# EasyEDA Pro project HV55708转接板.eprj

# Schematic Schematic1
Board Name: Board1
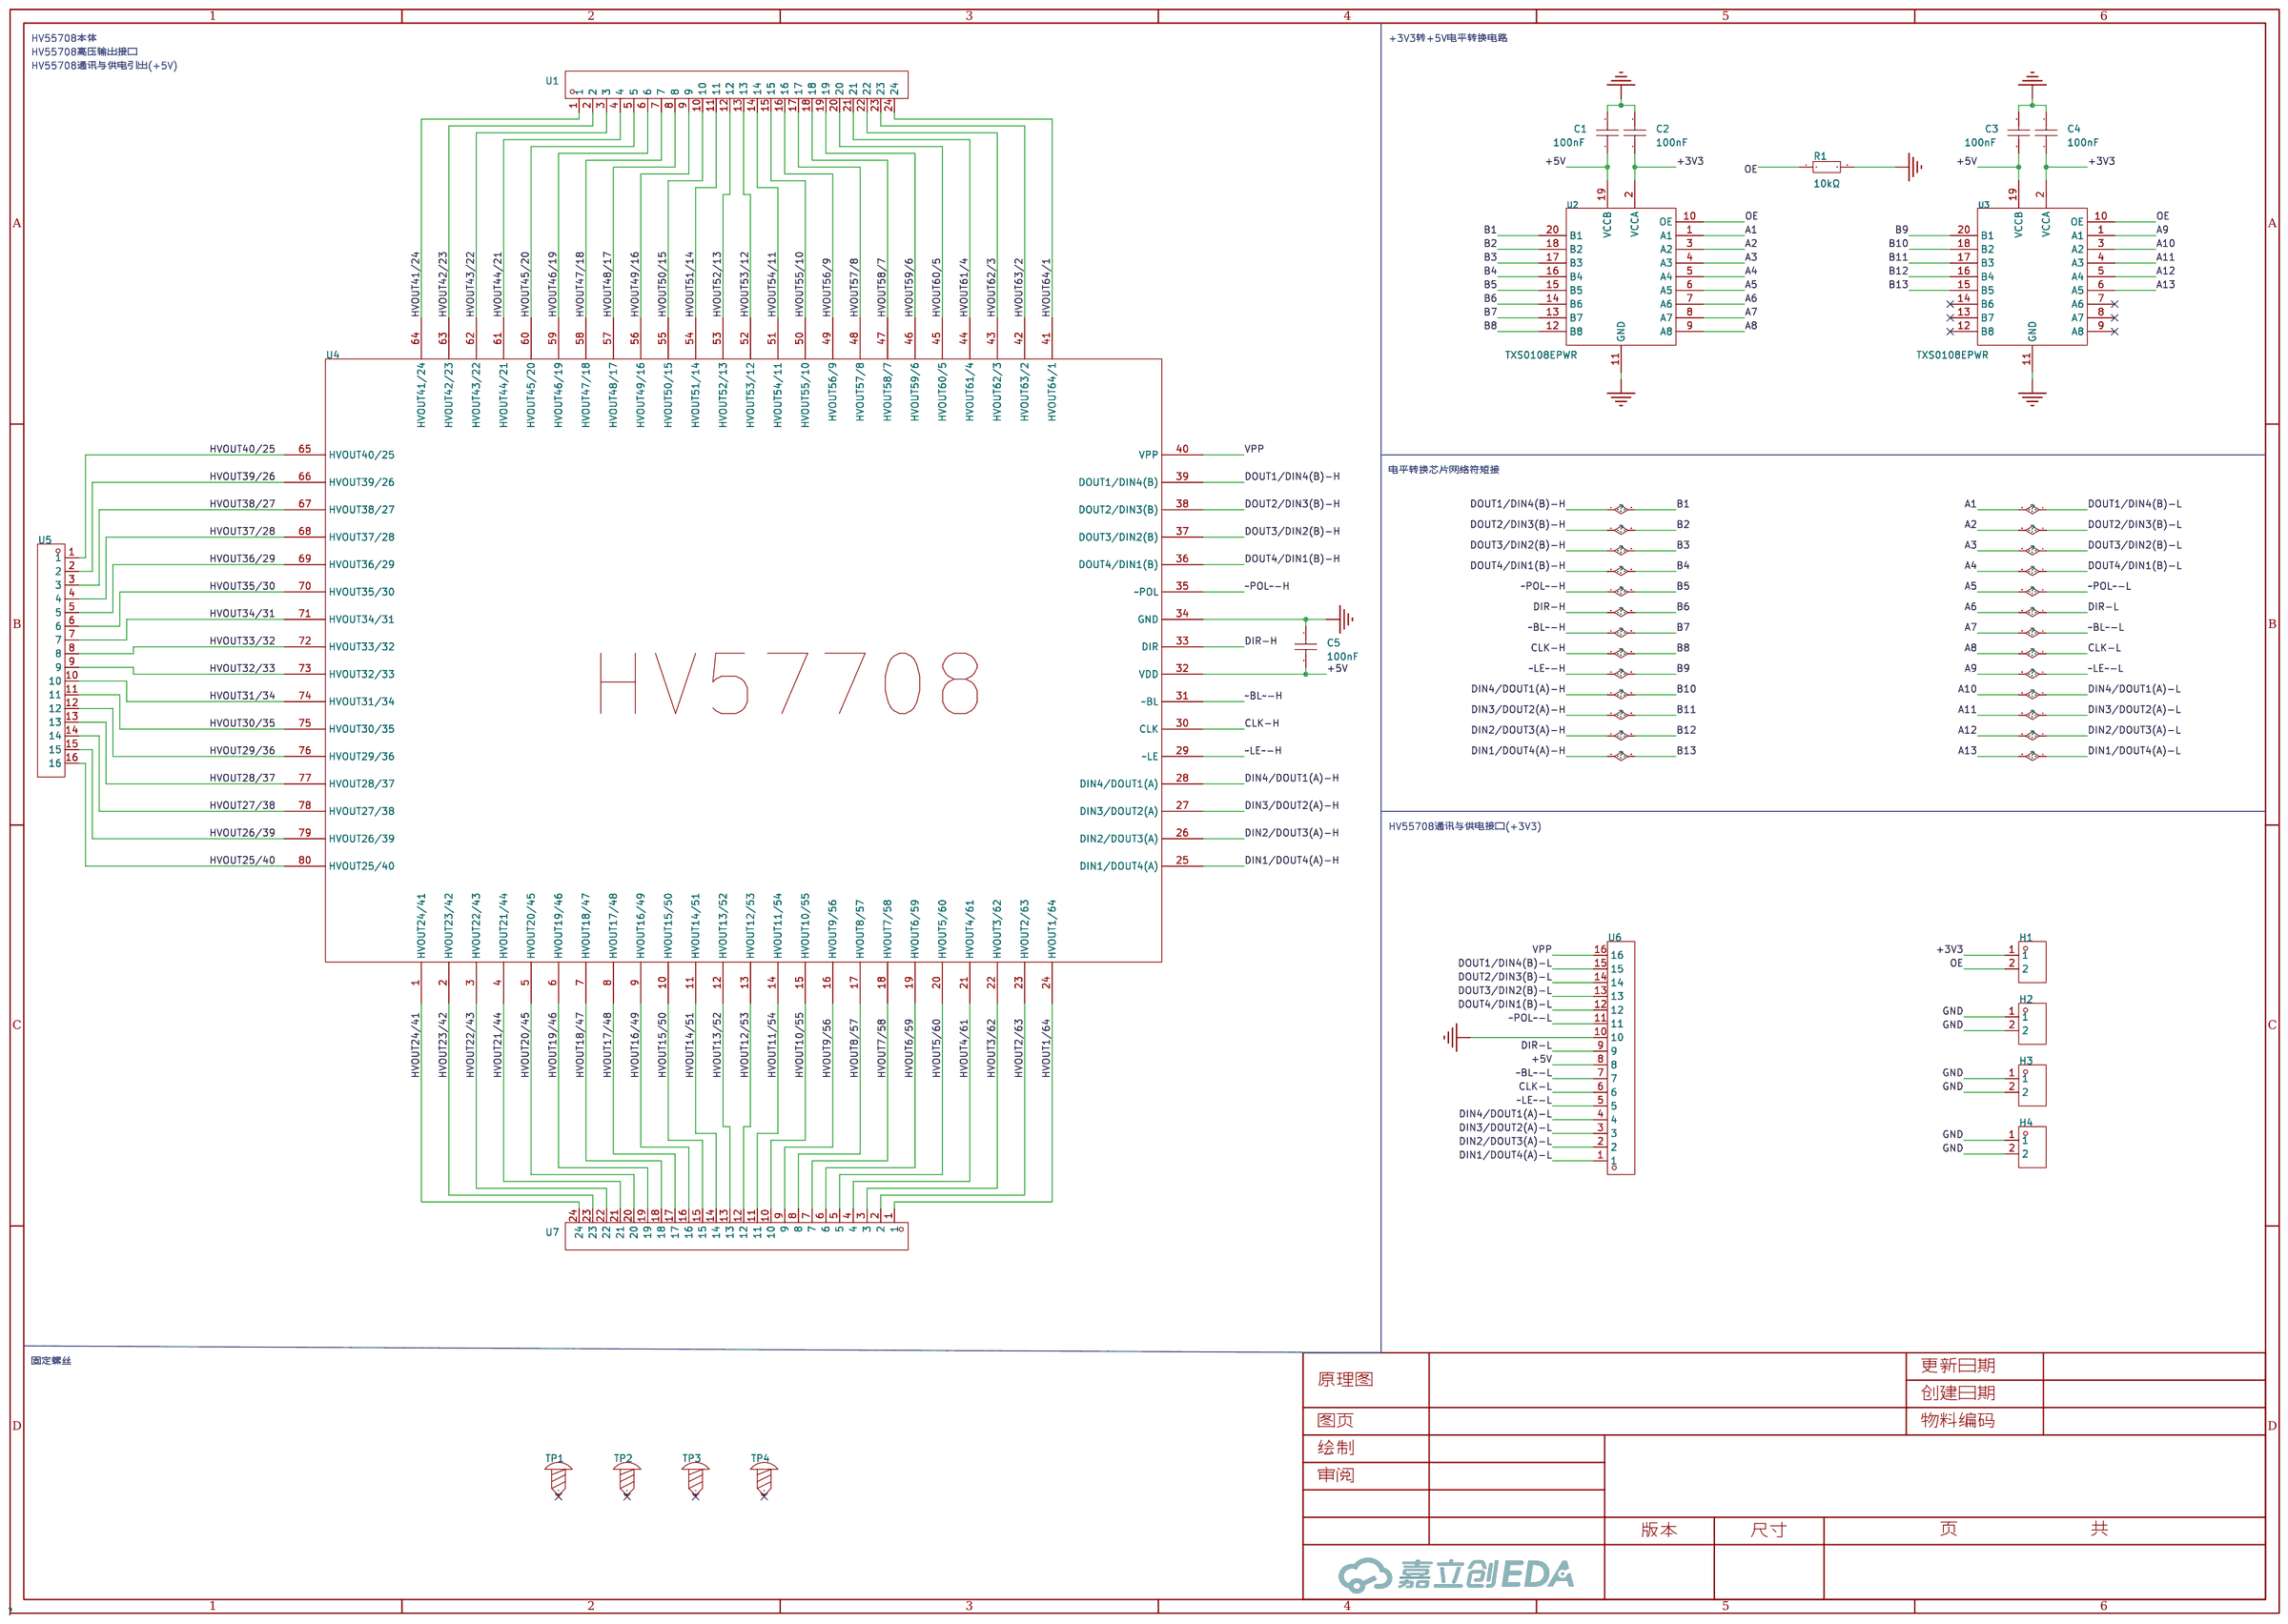
[diagram p0: schematic sheet]

## Parts
C1  100nF  [C0805]
C2  100nF  [C0805]
C3  100nF  [C0805]
C4  100nF  [C0805]
C5  100nF  [C0805]
H1  2.0MM排针,2P  [HDR-TH_2P-P2.00-V-M]
H2  2.0MM排针,2P  [HDR-TH_2P-P2.00-V-M]
H3  2.0MM排针,2P  [HDR-TH_2P-P2.00-V-M]
H4  2.0MM排针,2P  [HDR-TH_2P-P2.00-V-M]
R1  10kΩ  [R0805]
TP1  -  [M3螺丝]
TP2  -  [M3螺丝]
TP3  -  [M3螺丝]
TP4  -  [M3螺丝]
U1  TH2.54-24P排针(母)(邮寄专用)  [HDR-TH_24P-P2.54-V-F]
U2  TXS0108EPWR  [TSSOP-20_L6.5-W4.4-P0.65-LS6.4-BL]
U3  TXS0108EPWR  [TSSOP-20_L6.5-W4.4-P0.65-LS6.4-BL]
U4  -  [HV57708PG]
U5  6-146285-6  [HDR-TH_16P-P2.54-V-M-2]
U6  6-146285-6  [HDR-TH_16P-P2.54-V-M-2]
U7  TH2.54-24P排针(母)(邮寄专用)  [HDR-TH_24P-P2.54-V-F]

## Library data of the parts
C1-C5 = CC0805KRX7R9BB104: LCSC Part Name: 100nF ±10% 50V; Supplier Part: C49678; Manufacturer: YAGEO(国巨); Supplier Footprint: 0805; JLCPCB Part Class: 基础库; Datasheet: https://atta.szlcsc.com/upload/public/pdf/source/20180224/C181747_15194369449651363981.pdf; Supplier: LCSC; Tolerance: ±10%; Voltage Rated: 50V; Temperature Coefficient: X7R
H1-H4 = 2.0MM排针,2P: Supplier Part: C9900021157; Supplier Footprint: HDR-TH-2P; JLCPCB Part Class: 扩展库; Supplier: LCSC
R1 = 0805W8F1002T5E_C17414: LCSC Part Name: 10kΩ ±1% 125mW 厚膜电阻; Supplier Part: C17414; Manufacturer: UNI-ROYAL(厚声); Manufacturer Part: 0805W8F1002T5E; Supplier Footprint: 0805; JLCPCB Part Class: 基础库; Datasheet: https://atta.szlcsc.com/upload/public/pdf/source/20200306/C422600_1E6D84923E4A46A82E41ADD87F860B5C.pdf; Supplier: LCSC; Type: 厚膜电阻; Tolerance: ±1%; Power(Watts): 125mW; Overload Voltage (Max): 150V; Temperature Coefficient: ±100ppm/℃; Operating Temperature Range: -55℃~+155℃
TP1-TP4 = M3螺丝: Supplier Footprint: 插件
U1 U7 = TH2.54-24P排针(母)(邮寄专用): Supplier Part: C9900014057; Supplier Footprint: HDR-TH_24P-P2.54-V-M; JLCPCB Part Class: 扩展库; Supplier: LCSC
U2 U3 = TXS0108EPWR: LCSC Part Name: 60Mbps 8位双向电平转换器; Supplier Part: C17206; Manufacturer: TI(德州仪器); Supplier Footprint: TSSOP-20; JLCPCB Part Class: 扩展库; Datasheet: http://www.ti.com/cn/lit/gpn/txs0108e; Supplier: LCSC; Channel Type: 双向; Data Rate: 60Mbps; Supply Voltage (VCCA): 1.4V~3.6V; Supply Voltage (VCCB): 1.65V~5.5V; Number of Circuits: 1; Channels per Circuit: 8; Output Type: 开路漏极；推挽式; Operating Temperature: -40℃~+85℃; Features: 自动方向检测
U4 = HV57708
U5 U6 = 6-146285-6: LCSC Part Name: 间距:2.54mm 直插; Supplier Part: C6823671; Manufacturer: TE Connectivity(泰科电子); Supplier Footprint: 插件,P=2.54mm; JLCPCB Part Class: 扩展库; Datasheet: https://atta.szlcsc.com/upload/public/pdf/source/231023/ENG_CD_146285_J1.pdf-b0a2bf7617cda9a1e20227fe7514b3a4.pdf; Supplier: LCSC; Pitch: 2.54mm; Mounting Type: 直插; Number of Rows: 单排; Number of Pins: 16P; Current Rating (Max): 3A; Contact Material: 铜合金; Contact Plating: 锡; Operating Temperature Range: -65℃~+105℃; Color: 黑色

## Nets
+3V3: C2.1 C4.1 H1.1 U2.2(VCCA) U3.2(VCCA)
+5V: C1.1 C3.1 C5.1 U2.19(VCCB) U3.19(VCCB) U4.32(VDD) U6.8
GND: C1.2 C2.2 C3.2 C4.2 C5.2 H2.1 H2.2 H3.1 H3.2 H4.1 H4.2 R1.2 U2.11(GND) U3.11(GND) U4.34(GND) U6.10
A1: U2.1(A1) U6.15
A2: U2.3(A2) U6.14
A3: U2.4(A3) U6.13
A4: U2.5(A4) U6.12
A5: U2.6(A5) U6.11
A6: U2.7(A6) U6.9
A7: U2.8(A7) U6.7
A8: U2.9(A8) U6.6
A9: U3.1(A1) U6.5
A10: U3.3(A2) U6.4
A11: U3.4(A3) U6.3
A12: U3.5(A4) U6.2
A13: U3.6(A5) U6.1
B1: U2.20(B1) U4.39(DOUT1/DIN4(B))
B2: U2.18(B2) U4.38(DOUT2/DIN3(B))
B3: U2.17(B3) U4.37(DOUT3/DIN2(B))
B4: U2.16(B4) U4.36(DOUT4/DIN1(B))
B5: U2.15(B5) U4.35(~POL)
B6: U2.14(B6) U4.33(DIR)
B7: U2.13(B7) U4.31(~BL)
B8: U2.12(B8) U4.30(CLK)
B9: U3.20(B1) U4.29(~LE)
B10: U3.18(B2) U4.28(DIN4/DOUT1(A))
B11: U3.17(B3) U4.27(DIN3/DOUT2(A))
B12: U3.16(B4) U4.26(DIN2/DOUT3(A))
B13: U3.15(B5) U4.25(DIN1/DOUT4(A))
HVOUT1/64: U4.24(HVOUT1/64) U7.1
HVOUT2/63: U4.23(HVOUT2/63) U7.2
HVOUT3/62: U4.22(HVOUT3/62) U7.3
HVOUT4/61: U4.21(HVOUT4/61) U7.4
HVOUT5/60: U4.20(HVOUT5/60) U7.5
HVOUT6/59: U4.19(HVOUT6/59) U7.6
HVOUT7/58: U4.18(HVOUT7/58) U7.7
HVOUT8/57: U4.17(HVOUT8/57) U7.8
HVOUT9/56: U4.16(HVOUT9/56) U7.9
HVOUT10/55: U4.15(HVOUT10/55) U7.10
HVOUT11/54: U4.14(HVOUT11/54) U7.11
HVOUT12/53: U4.13(HVOUT12/53) U7.12
HVOUT13/52: U4.12(HVOUT13/52) U7.13
HVOUT14/51: U4.11(HVOUT14/51) U7.14
HVOUT15/50: U4.10(HVOUT15/50) U7.15
HVOUT16/49: U4.9(HVOUT16/49) U7.16
HVOUT17/48: U4.8(HVOUT17/48) U7.17
HVOUT18/47: U4.7(HVOUT18/47) U7.18
HVOUT19/46: U4.6(HVOUT19/46) U7.19
HVOUT20/45: U4.5(HVOUT20/45) U7.20
HVOUT21/44: U4.4(HVOUT21/44) U7.21
HVOUT22/43: U4.3(HVOUT22/43) U7.22
HVOUT23/42: U4.2(HVOUT23/42) U7.23
HVOUT24/41: U4.1(HVOUT24/41) U7.24
HVOUT25/40: U4.80(HVOUT25/40) U5.16
HVOUT26/39: U4.79(HVOUT26/39) U5.15
HVOUT27/38: U4.78(HVOUT27/38) U5.14
HVOUT28/37: U4.77(HVOUT28/37) U5.13
HVOUT29/36: U4.76(HVOUT29/36) U5.12
HVOUT30/35: U4.75(HVOUT30/35) U5.11
HVOUT31/34: U4.74(HVOUT31/34) U5.10
HVOUT32/33: U4.73(HVOUT32/33) U5.9
HVOUT33/32: U4.72(HVOUT33/32) U5.8
HVOUT34/31: U4.71(HVOUT34/31) U5.7
HVOUT35/30: U4.70(HVOUT35/30) U5.6
HVOUT36/29: U4.69(HVOUT36/29) U5.5
HVOUT37/28: U4.68(HVOUT37/28) U5.4
HVOUT38/27: U4.67(HVOUT38/27) U5.3
HVOUT39/26: U4.66(HVOUT39/26) U5.2
HVOUT40/25: U4.65(HVOUT40/25) U5.1
HVOUT41/24: U1.1 U4.64(HVOUT41/24)
HVOUT42/23: U1.2 U4.63(HVOUT42/23)
HVOUT43/22: U1.3 U4.62(HVOUT43/22)
HVOUT44/21: U1.4 U4.61(HVOUT44/21)
HVOUT45/20: U1.5 U4.60(HVOUT45/20)
HVOUT46/19: U1.6 U4.59(HVOUT46/19)
HVOUT47/18: U1.7 U4.58(HVOUT47/18)
HVOUT48/17: U1.8 U4.57(HVOUT48/17)
HVOUT49/16: U1.9 U4.56(HVOUT49/16)
HVOUT50/15: U1.10 U4.55(HVOUT50/15)
HVOUT51/14: U1.11 U4.54(HVOUT51/14)
HVOUT52/13: U1.12 U4.53(HVOUT52/13)
HVOUT53/12: U1.13 U4.52(HVOUT53/12)
HVOUT54/11: U1.14 U4.51(HVOUT54/11)
HVOUT55/10: U1.15 U4.50(HVOUT55/10)
HVOUT56/9: U1.16 U4.49(HVOUT56/9)
HVOUT57/8: U1.17 U4.48(HVOUT57/8)
HVOUT58/7: U1.18 U4.47(HVOUT58/7)
HVOUT59/6: U1.19 U4.46(HVOUT59/6)
HVOUT60/5: U1.20 U4.45(HVOUT60/5)
HVOUT61/4: U1.21 U4.44(HVOUT61/4)
HVOUT62/3: U1.22 U4.43(HVOUT62/3)
HVOUT63/2: U1.23 U4.42(HVOUT63/2)
HVOUT64/1: U1.24 U4.41(HVOUT64/1)
OE: H1.2 R1.1 U2.10(OE) U3.10(OE)
VPP: U4.40(VPP) U6.16

Not connected (* = marked no-connect by the designer): TP1 1*; TP2 1*; TP3 1*; TP4 1*; U3 7(A6)* 8(A7)* 9(A8)* 12(B8)* 13(B7)* 14(B6)*

## Notes on the sheet
- HV55708本体
- +3V3转+5V电平转换电路
- HV55708高压输出接口
- HV55708通讯与供电引出(+5V)
- 电平转换芯片网络符短接
- HV55708通讯与供电接口(+3V3)
- 固定螺丝

# Board PCB1
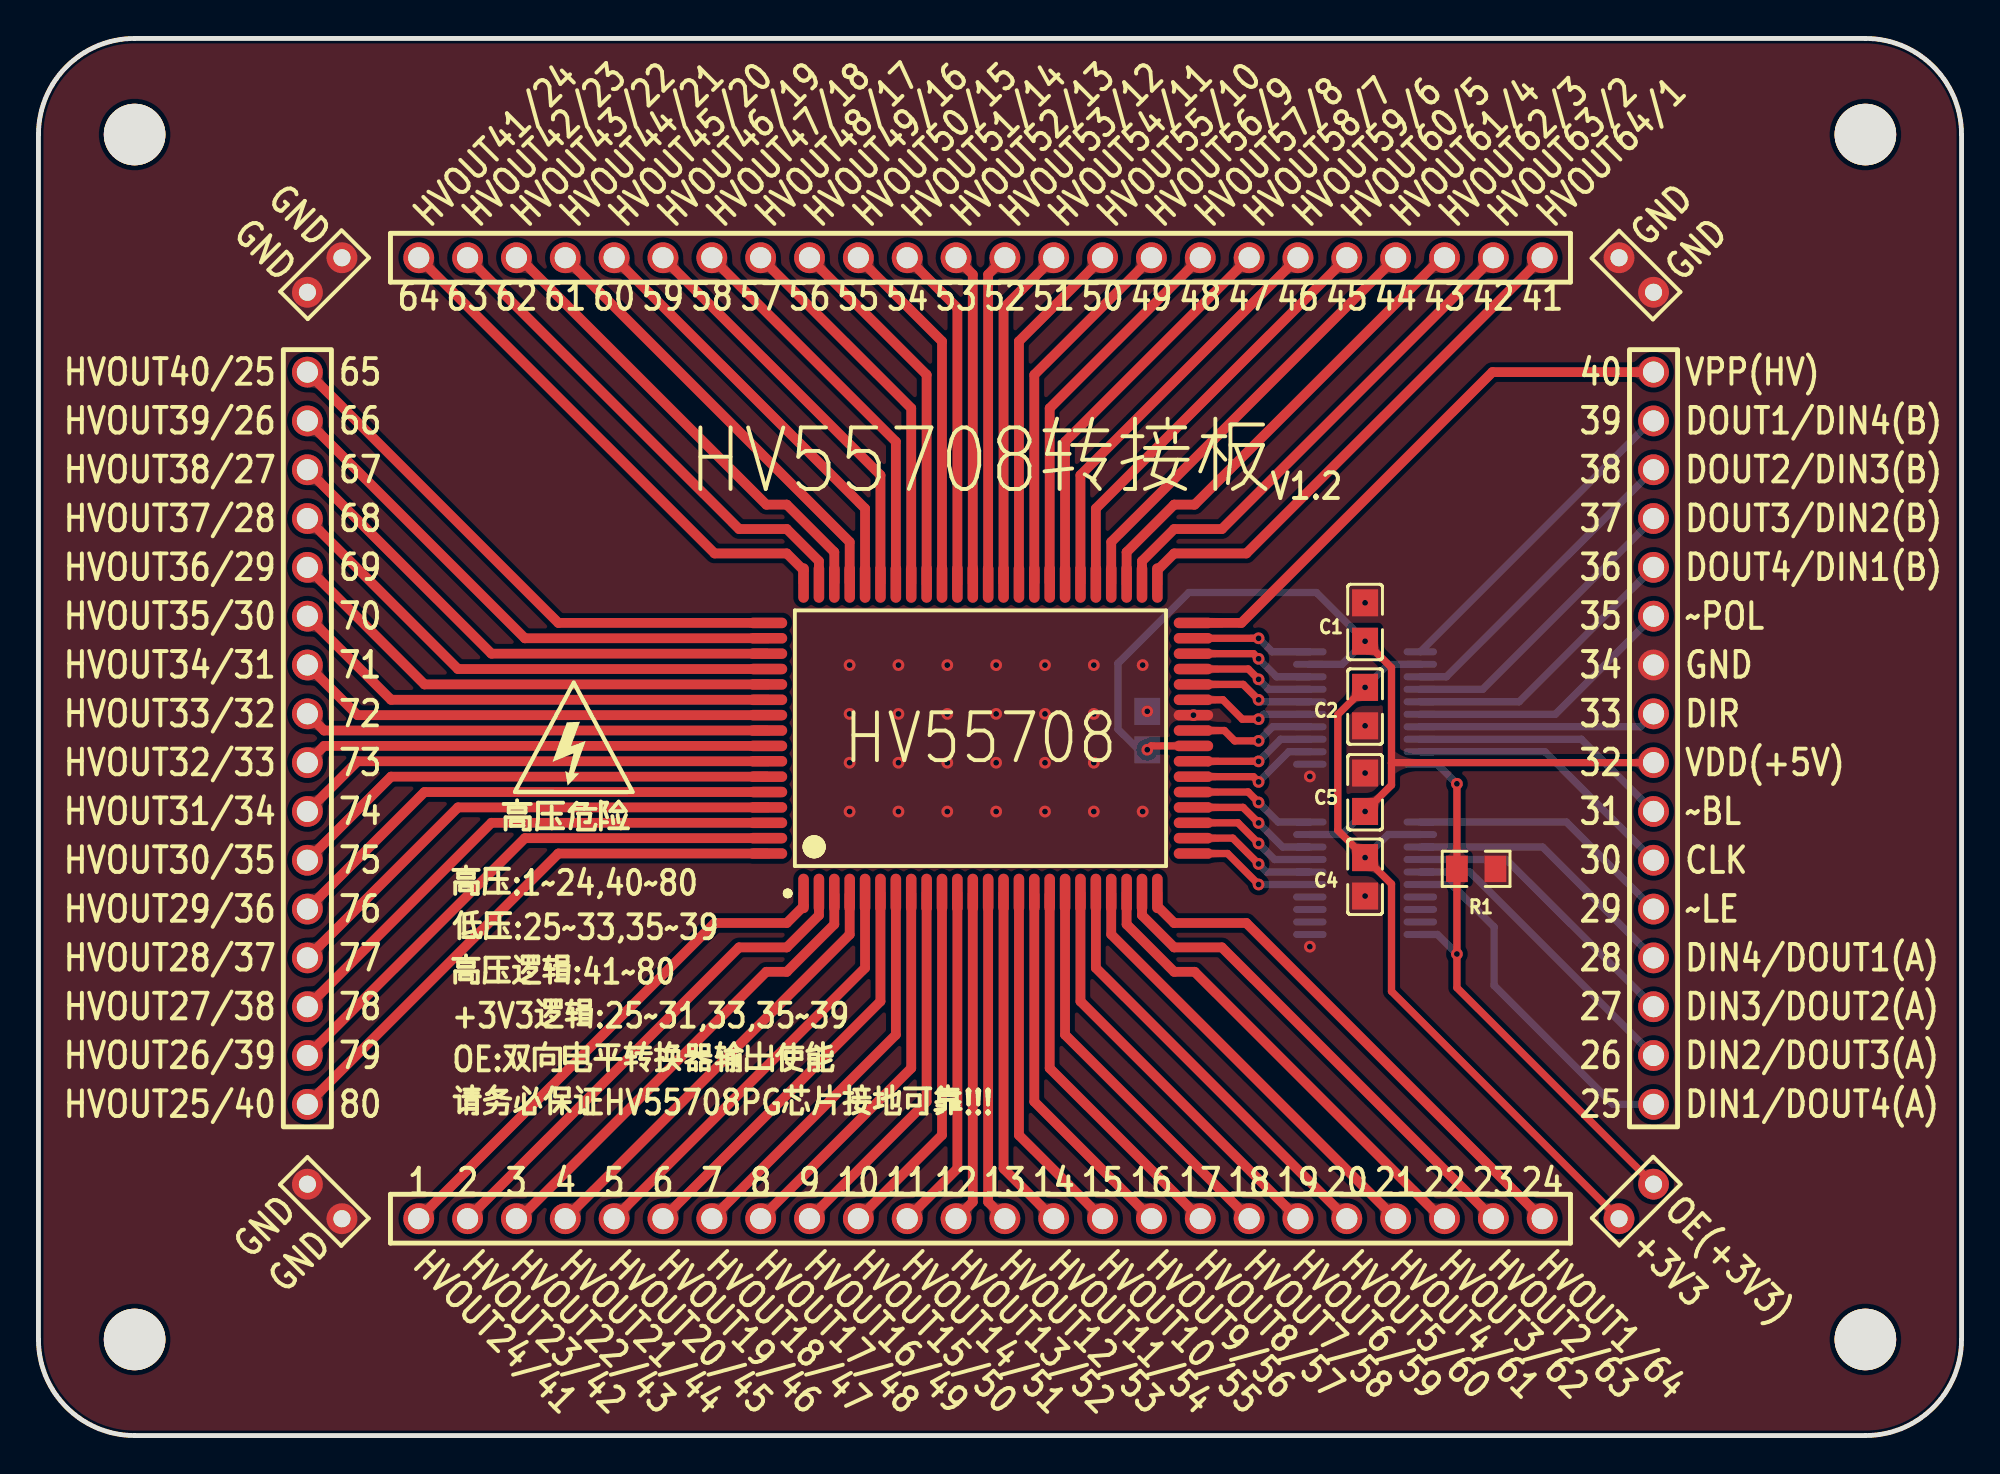
[diagram p1: board, top side]
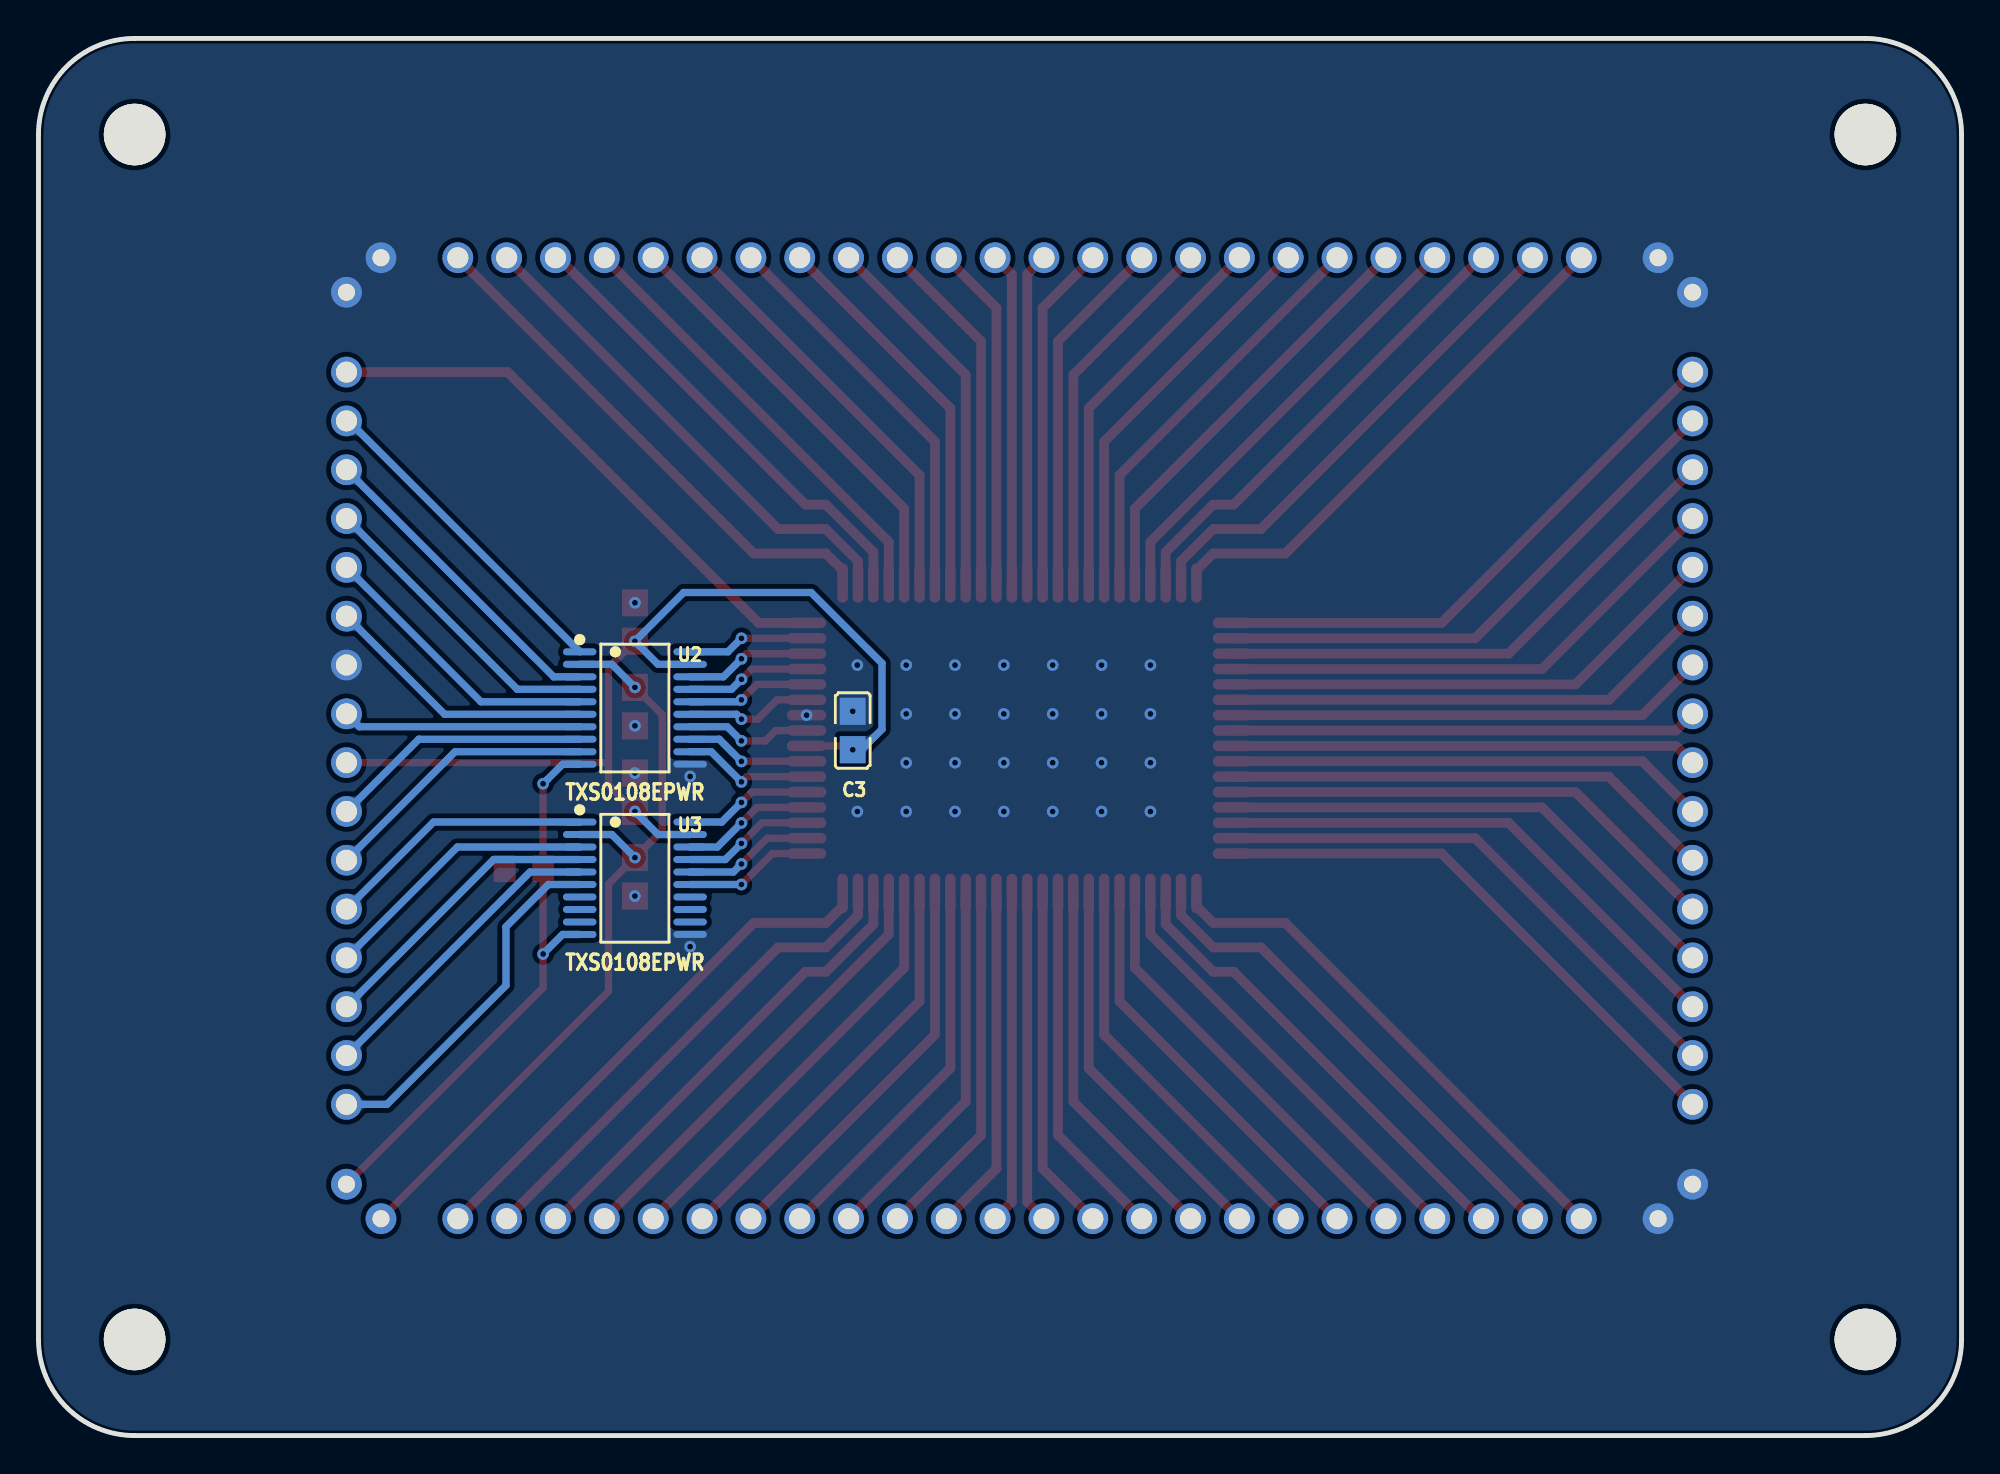
[diagram p2: board, bottom side, seen from below]

Outline 100 x 72.69 mm; copper layers: Top Layer, Bottom Layer. Coordinates in mm from the lower left corner of the outline.
Outline path: 0,67.69 0,5 arc(1.46,1.46) 5,0 95,0 arc(98.54,1.46) 100,5 100,67.69 arc(98.54,71.23) 95,72.69 5,72.69 arc(1.46,71.23) 0,67.69
Stack: Top Layer 0.035mm / Dielectric1 1.51mm FR4 er 4.5 / Bottom Layer 0.035mm

## Design rules (mm)
template: 自定义配置
spacing copperThickness1oz (default): track to track 0.102, other pairs 0.152 to 0.3
spacing copperThickness2oz: track to track 0.203, other pairs 0.152 to 0.3
track width copperThickness1oz (default): min 0.127, default 0.254, max 2.54
track width copperThickness2oz: min 0.203, default 0.254, max 2.54
differential pair differentialPair (default): width min 0.127, default 0.254, max 2.54; gap min 0.152, default 0.152
via viaSize (default): diameter min 0.5, default 0.61, max 10; hole min 0.3, default 0.305, max 6.299
net GND uses 直连

## Placement (name value [footprint] x y rotation side)
C1  100nF  [C0805]  68.98 42.33 90 top
C2  100nF  [C0805]  68.98 37.93 270 top
C3  100nF  [C0805]  57.66 36.68 90 bottom
C4  100nF  [C0805]  68.98 29.07 270 top
C5  100nF  [C0805]  68.98 33.47 90 top
H1  2.0MM排针,2P  [HDR-TH_2P-P2.00-V-M]  83.09 12.18 45 top
H2  2.0MM排针,2P  [HDR-TH_2P-P2.00-V-M]  14.88 12.18 135 top
H3  2.0MM排针,2P  [HDR-TH_2P-P2.00-V-M]  14.88 60.38 45 top
H4  2.0MM排针,2P  [HDR-TH_2P-P2.00-V-M]  83.09 60.38 135 top
R1  10kΩ  [R0805]  74.76 29.49 0 top
TP1  -  [M3螺丝]  5.06 67.63 0 top
TP2  -  [M3螺丝]  95.06 67.63 0 top
TP3  -  [M3螺丝]  5.06 4.94 0 top
TP4  -  [M3螺丝]  95.06 4.94 0 top
U1  TH2.54-24P排针(母)(邮寄专用)  [HDR-TH_24P-P2.54-V-F]  48.98 61.28 0 top
U2  TXS0108EPWR  [TSSOP-20_L6.5-W4.4-P0.65-LS6.4-BL]  68.98 37.85 270 bottom
U3  TXS0108EPWR  [TSSOP-20_L6.5-W4.4-P0.65-LS6.4-BL]  68.98 29 270 bottom
U4  -  [HV57708PG]  48.98 36.28 90 top
U5  6-146285-6  [HDR-TH_16P-P2.54-V-M-2]  13.98 36.28 270 top
U6  6-146285-6  [HDR-TH_16P-P2.54-V-M-2]  83.98 36.28 90 top
U7  TH2.54-24P排针(母)(邮寄专用)  [HDR-TH_24P-P2.54-V-F]  48.98 11.28 180 top

## Footprints (pads in the part's own frame, mm; a bottom-side part is the same pattern mirrored in y, then rotated)
C0805
  rect 1.41x1.35 smd: 1(-1,0) 2(1,0)
HDR-TH_2P-P2.00-V-M
  round 1.6 hole 0.889: 1(-1.27,0) 2(1.27,0)
HDR-TH_16P-P2.54-V-M-2
  round 1.6 hole 1.1x0.89: 1(-19.05,0) 2(-16.51,0) 3(-13.97,0) 4(-11.43,0) 5(-8.89,0) 6(-6.35,0) 7(-3.81,0) 8(-1.27,0) 9(1.27,0) 10(3.81,0) 11(6.35,0) 12(8.89,0) 13(11.43,0) 14(13.97,0) 15(16.51,0) 16(19.05,0)
HDR-TH_24P-P2.54-V-F
  round 1.6 hole 1.1x0.89: 1(-29.21,0) 2(-26.67,0) 3(-24.13,0) 4(-21.59,0) 5(-19.05,0) 6(-16.51,0) 7(-13.97,0) 8(-11.43,0) 9(-8.89,0) 10(-6.35,0) 11(-3.81,0) 12(-1.27,0) 13(1.27,0) 14(3.81,0) 15(6.35,0) 16(8.89,0) 17(11.43,0) 18(13.97,0) 19(16.51,0) 20(19.05,0) 21(21.59,0) 22(24.13,0) 23(26.67,0) 24(29.21,0)
HV57708PG
  oval 2.05x0.55 smd: 1(-8.075,9.2) 2(-8.075,8.4) 3(-8.075,7.6) 4(-8.075,6.8) 5(-8.075,6) 6(-8.075,5.2) 7(-8.075,4.4) 8(-8.075,3.6) 9(-8.075,2.8) 10(-8.075,2) 11(-8.075,1.2) 12(-8.075,0.4) 13(-8.075,-0.4) 14(-8.075,-1.2) 15(-8.075,-2) 16(-8.075,-2.8) 17(-8.075,-3.6) 18(-8.075,-4.4) 19(-8.075,-5.2) 20(-8.075,-6) 21(-8.075,-6.8) 22(-8.075,-7.6) 23(-8.075,-8.4) 24(-8.075,-9.2) 41(8.075,-9.2) 42(8.075,-8.4) 43(8.075,-7.6) 44(8.075,-6.8) 45(8.075,-6) 46(8.075,-5.2) 47(8.075,-4.4) 48(8.075,-3.6) 49(8.075,-2.8) 50(8.075,-2) 51(8.075,-1.2) 52(8.075,-0.4) 53(8.075,0.4) 54(8.075,1.2) 55(8.075,2) 56(8.075,2.8) 57(8.075,3.6) 58(8.075,4.4) 59(8.075,5.2) 60(8.075,6) 61(8.075,6.8) 62(8.075,7.6) 63(8.075,8.4) 64(8.075,9.2)
  oval 0.55x2.05 smd: 25(-6,-11.075) 26(-5.2,-11.075) 27(-4.4,-11.075) 28(-3.6,-11.075) 29(-2.8,-11.075) 30(-2,-11.075) 31(-1.2,-11.075) 32(-0.4,-11.075) 33(0.4,-11.075) 34(1.2,-11.075) 35(2,-11.075) 36(2.8,-11.075) 37(3.6,-11.075) 38(4.4,-11.075) 39(5.2,-11.075) 40(6,-11.075) 65(6,11.075) 66(5.2,11.075) 67(4.4,11.075) 68(3.6,11.075) 69(2.8,11.075) 70(2,11.075) 71(1.2,11.075) 72(0.4,11.075) 73(-0.4,11.075) 74(-1.2,11.075) 75(-2,11.075) 76(-2.8,11.075) 77(-3.6,11.075) 78(-4.4,11.075) 79(-5.2,11.075) 80(-6,11.075)
M3螺丝
  round 3.2 hole 3.2: 1(-0.064,0.064)
R0805
  rect 1.133x1.377 smd: 1(-1,0) 2(1,0)
TSSOP-20_L6.5-W4.4-P0.65-LS6.4-BL
  oval 0.364x1.742 smd: 1(-2.925,-2.871) 2(-2.275,-2.871) 3(-1.625,-2.871) 4(-0.975,-2.871) 5(-0.325,-2.871) 6(0.325,-2.871) 7(0.975,-2.871) 8(1.625,-2.871) 9(2.275,-2.871) 10(2.925,-2.871) 11(2.925,2.871) 12(2.275,2.871) 13(1.625,2.871) 14(0.975,2.871) 15(0.325,2.871) 16(-0.325,2.871) 17(-0.975,2.871) 18(-1.625,2.871) 19(-2.275,2.871) 20(-2.925,2.871)

## Nets
As in the schematic.

Pads without a net: TP1 1; TP2 1; TP3 1; TP4 1; U3 7 8 9 12 13 14

## Via types
v1: diameter 0.61, hole 0.305, Top Layer to Bottom Layer, 54 vias

## Routing (per net, layer and track width the routed paths; a pad name or vN(x,y) marks a point on that pad's centre or on a via; arc(x,y) is an arc through that point)
+3V3: length 41
  Top Layer w0.381: H1.1 70.36,23.11 70.36,28.7 v1(68.98,30.07) 67.56,31.49 67.56,37.51 v1(68.98,38.93)
  Bottom Layer w0.381: U2.2 70.18,40.13 v1(68.98,38.93) ; v1(68.98,30.07) 70.18,31.27 U3.2
+5V: length 53.7
  Top Layer w0.381: U6.8 70.38,35.01 70.36,34.99 ; v1(68.98,41.33) 70.36,39.96 70.36,34.99 ; v1(68.98,32.47) 70.36,33.85 70.36,34.99 ; v1(57.66,35.68) 57.86,35.88 U4.32
  Bottom Layer w0.381: U2.19 67.78,40.13 v1(68.98,41.33) 66.45,43.87 59.82,43.87 56.13,40.18 56.13,36.75 57.2,35.68 v1(57.66,35.68) ; v1(68.98,32.47) 67.78,31.27 U3.19
GND:
  vias: v1(42.18,40.09) v1(42.18,37.55) v1(42.18,35.01) v1(42.18,32.47) v1(44.72,40.09) v1(44.72,37.55) v1(44.72,35.01) v1(44.72,32.47) v1(47.26,40.09) v1(47.26,37.55) v1(47.26,35.01) v1(47.26,32.47) v1(49.8,40.09) v1(49.8,37.55) v1(49.8,35.01) v1(49.8,32.47) v1(52.34,40.09) v1(52.34,37.55) v1(52.34,35.01) v1(52.34,32.47) v1(54.88,40.09) v1(54.88,37.55) v1(54.88,35.01) v1(54.88,32.47) v1(57.42,40.09) v1(57.42,32.47) v1(57.66,37.68) v1(60.06,37.48) v1(66.11,34.29) v1(66.11,25.44) v1(68.98,43.33) v1(68.98,36.93) v1(68.98,34.47) v1(68.98,28.07)
A1: length 17.1
  Bottom Layer w0.381: U2.1 83.87,52.79 83.98,52.79
A2: length 16.6
  Bottom Layer w0.381: U2.3 73.21,39.48 U6.14
A3: length 15.8
  Bottom Layer w0.381: 71.85,38.83 75.1,38.83 U6.13
A4: length 15
  Bottom Layer w0.381: U2.5 76.99,38.18 U6.12
A5: length 14.2
  Bottom Layer w0.381: U6.11 78.88,37.53 U2.6
A6: length 12.4
  Bottom Layer w0.381: U6.9 83.31,36.88 U2.7
A7: length 13.7
  Bottom Layer w0.381: U2.8 80.23,36.23 U6.7
A8: length 14.5
  Bottom Layer w0.381: U6.6 78.34,35.58 U2.9
A9: length 14
  Bottom Layer w0.381: U6.5 79.46,31.92 U3.1
A10: length 14.5
  Bottom Layer w0.381: U3.3 78.22,30.62 83.98,24.85
A11: length 15.3
  Bottom Layer w0.381: U6.3 76.32,29.97 U3.4
A12: length 16.1
  Bottom Layer w0.381: U6.2 74.44,29.32 U3.5
A13: length 18.7
  Bottom Layer w0.381: U6.1 81.88,17.23 75.69,23.42 75.69,26.47 73.49,28.67 U3.6
B1: length 6.3
  Top Layer w0.381: U4.39 v1(63.45,41.48)
  Bottom Layer w0.381: v1(63.45,41.48) 64.15,40.78 U2.20
B2: length 6.6
  Top Layer w0.381: v1(63.45,40.42) 63.18,40.68 U4.38
  Bottom Layer w0.381: v1(63.45,40.42) 64.38,39.48 U2.18
B3: length 6.5
  Top Layer w0.381: U4.37 62.91,39.88 v1(63.45,39.35)
  Bottom Layer w0.381: 66.11,38.83 63.96,38.83 v1(63.45,39.35)
B4: length 6.4
  Top Layer w0.381: U4.36 62.64,39.08 v1(63.45,38.28)
  Bottom Layer w0.381: v1(63.45,38.28) 63.55,38.18 U2.16
B5: length 6.6
  Top Layer w0.381: v1(63.45,37.27) 62.6,37.27 61.59,38.28 U4.35
  Bottom Layer w0.381: U2.15 63.7,37.53 v1(63.45,37.27)
B6: length 6.6
  Top Layer w0.381: v1(63.45,36.15) 62.2,36.15 61.66,36.68 U4.33
  Bottom Layer w0.381: v1(63.45,36.15) 64.18,36.88 U2.14
B7: length 6.5
  Top Layer w0.381: v1(63.45,35.08) 63.44,35.08 U4.31
  Bottom Layer w0.381: v1(63.45,35.08) 64.6,36.23 U2.13
B8: length 6.8
  Top Layer w0.381: U4.30 63.17,34.28 v1(63.45,34.01)
  Bottom Layer w0.381: v1(63.45,34.01) 65.01,35.58 U2.12
B9: length 6.7
  Top Layer w0.381: v1(63.45,32.94) 62.91,33.48 U4.29
  Bottom Layer w0.381: v1(63.45,32.94) 64.47,31.92 U3.20
B10: length 6.9
  Top Layer w0.381: v1(63.45,31.88) 62.64,32.68 U4.28
  Bottom Layer w0.381: U3.18 64.7,30.62 v1(63.45,31.88)
B11: length 6.8
  Top Layer w0.381: v1(63.45,30.81) 62.37,31.88 U4.27
  Bottom Layer w0.381: U3.17 64.28,29.97 v1(63.45,30.81)
B12: length 6.8
  Top Layer w0.381: v1(63.45,29.74) 62.1,31.08 U4.26
  Bottom Layer w0.381: U3.16 63.86,29.32 v1(63.45,29.74)
B13: length 6.7
  Top Layer w0.381: U4.25 61.84,30.28 v1(63.45,28.67)
  Bottom Layer w0.381: v1(63.45,28.67) U3.15
HVOUT1/64: length 27.4
  Top Layer w0.508: U7.1 62.81,26.67 59.06,26.67 58.18,27.54 U4.24
HVOUT2/63: length 25.9
  Top Layer w0.508: U7.2 61.54,25.4 59.06,25.4 57.38,27.07 U4.23
HVOUT3/62: length 24.5
  Top Layer w0.508: U4.22 56.58,26.6 59.06,24.13 60.12,24.13 72.97,11.28 U7.3
HVOUT4/61: length 23.1
  Top Layer w0.508: U4.21 55.78,26.07 U7.4
HVOUT5/60: length 22.3
  Top Layer w0.508: U7.5 54.98,24.33 U4.20
HVOUT6/59: length 21.6
  Top Layer w0.508: U7.6 54.18,22.59 U4.19
HVOUT7/58: length 20.9
  Top Layer w0.508: U7.7 53.38,20.85 U4.18
HVOUT8/57: length 20.2
  Top Layer w0.508: U7.8 52.58,19.11 U4.17
HVOUT9/56: length 19.4
  Top Layer w0.508: U4.16 51.78,17.37 U7.9
HVOUT10/55: length 18.7
  Top Layer w0.508: U4.15 50.98,15.63 U7.10
HVOUT11/54: length 18
  Top Layer w0.508: U4.14 50.18,13.89 U7.11
HVOUT12/53: length 17.3
  Top Layer w0.508: U7.12 49.38,12.15 U4.13
HVOUT13/52: length 17.3
  Top Layer w0.508: U4.12 48.58,12.15 U7.13
HVOUT14/51: length 18
  Top Layer w0.508: U4.11 47.78,13.89 U7.14
HVOUT15/50: length 18.7
  Top Layer w0.508: U7.15 46.98,15.63 U4.10
HVOUT16/49: length 19.4
  Top Layer w0.508: U4.9 46.18,17.37 U7.16
HVOUT17/48: length 20.2
  Top Layer w0.508: U4.8 45.38,19.11 U7.17
HVOUT18/47: length 20.9
  Top Layer w0.508: U4.7 44.58,20.85 U7.18
HVOUT19/46: length 21.6
  Top Layer w0.508: U4.6 43.78,22.59 U7.19
HVOUT20/45: length 22.3
  Top Layer w0.508: U7.20 42.98,24.33 U4.5
HVOUT21/44: length 23.1
  Top Layer w0.508: U4.4 42.18,26.07 U7.21
HVOUT22/43: length 24.5
  Top Layer w0.508: U4.3 41.38,26.6 38.91,24.13 37.85,24.13 25,11.28 U7.22
HVOUT23/42: length 25.9
  Top Layer w0.508: U4.2 40.58,27.07 38.91,25.4 36.43,25.4 U7.23
HVOUT24/41: length 27.4
  Top Layer w0.508: U7.24 35.16,26.67 38.91,26.67 39.78,27.54 U4.1
HVOUT25/40: length 29.3
  Top Layer w0.508: U5.16 27.03,30.28 37.91,30.28
HVOUT26/39: length 28.6
  Top Layer w0.508: U5.15 25.29,31.08 37.91,31.08
HVOUT27/38: length 27.9
  Top Layer w0.508: U5.14 23.55,31.88 37.91,31.88
HVOUT28/37: length 27.2
  Top Layer w0.508: 13.98,24.85 21.81,32.68 37.91,32.68
HVOUT29/36: length 26.4
  Top Layer w0.508: U5.12 20.07,33.48 37.91,33.48
HVOUT30/35: length 25.7
  Top Layer w0.508: 37.91,34.28 18.33,34.28 U5.11
HVOUT31/34: length 25
  Top Layer w0.508: U5.10 16.59,35.08 37.91,35.08
HVOUT32/33: length 24.3
  Top Layer w0.508: 37.91,35.88 14.85,35.88 U5.9
HVOUT33/32: length 24.3
  Top Layer w0.508: 37.91,36.68 14.85,36.68 U5.8
HVOUT34/31: length 25
  Top Layer w0.508: U5.7 16.59,37.48 37.91,37.48
HVOUT35/30: length 25.7
  Top Layer w0.508: U5.6 18.33,38.28 37.91,38.28
HVOUT36/29: length 26.4
  Top Layer w0.508: 37.91,39.08 20.07,39.08 U5.5
HVOUT37/28: length 27.2
  Top Layer w0.508: 37.91,39.88 21.81,39.88 U5.4
HVOUT38/27: length 27.9
  Top Layer w0.508: 37.91,40.68 23.55,40.68 U5.3
HVOUT39/26: length 28.6
  Top Layer w0.508: U5.2 25.29,41.48 37.91,41.48
HVOUT40/25: length 29.3
  Top Layer w0.508: U5.1 27.03,42.28 37.91,42.28
HVOUT41/24: length 27.4
  Top Layer w0.508: U4.64 39.78,45.03 38.91,45.9 35.16,45.9 U1.1
HVOUT42/23: length 25.9
  Top Layer w0.508: U4.63 40.58,45.5 38.91,47.17 36.43,47.17 U1.2
HVOUT43/22: length 24.5
  Top Layer w0.508: U4.62 41.38,45.97 38.91,48.44 37.85,48.44 25,61.28 U1.3
HVOUT44/21: length 23.1
  Top Layer w0.508: U1.4 42.18,46.49 U4.61
HVOUT45/20: length 22.3
  Top Layer w0.508: U4.60 42.98,48.23 U1.5
HVOUT46/19: length 21.6
  Top Layer w0.508: U4.59 43.78,49.97 U1.6
HVOUT47/18: length 20.9
  Top Layer w0.508: U1.7 44.58,51.71 U4.58
HVOUT48/17: length 20.2
  Top Layer w0.508: U4.57 45.38,53.45 U1.8
HVOUT49/16: length 19.4
  Top Layer w0.508: U1.9 46.18,55.19 U4.56
HVOUT50/15: length 18.7
  Top Layer w0.508: U4.55 46.98,56.93 U1.10
HVOUT51/14: length 18
  Top Layer w0.508: U4.54 47.78,58.67 U1.11
HVOUT52/13: length 17.3
  Top Layer w0.508: U1.12 48.58,60.41 U4.53
HVOUT53/12: length 17.3
  Top Layer w0.508: U4.52 49.38,60.41 U1.13
HVOUT54/11: length 18
  Top Layer w0.508: U4.51 50.18,58.67 U1.14
HVOUT55/10: length 18.7
  Top Layer w0.508: U1.15 50.98,56.93 U4.50
HVOUT56/9: length 19.4
  Top Layer w0.508: U4.49 51.78,55.19 U1.16
HVOUT57/8: length 20.2
  Top Layer w0.508: U1.17 52.58,53.45 U4.48
HVOUT58/7: length 20.9
  Top Layer w0.508: U4.47 53.38,51.71 U1.18
HVOUT59/6: length 21.6
  Top Layer w0.508: U1.19 54.18,49.97 U4.46
HVOUT60/5: length 22.3
  Top Layer w0.508: U1.20 54.98,48.23 U4.45
HVOUT61/4: length 23.1
  Top Layer w0.508: U4.44 55.78,46.49 U1.21
HVOUT62/3: length 24.5
  Top Layer w0.508: U4.43 56.58,45.97 59.06,48.44 60.12,48.44 72.97,61.28 U1.22
HVOUT63/2: length 25.9
  Top Layer w0.508: U1.23 61.54,47.17 59.06,47.17 57.38,45.5 U4.42
HVOUT64/1: length 27.4
  Top Layer w0.508: U1.24 62.81,45.9 59.06,45.9 58.18,45.03 U4.41
OE: length 29.7
  Top Layer w0.381: 83.99,13.08 73.76,23.3 v1(73.76,25.06) R1.1 v1(73.76,33.91)
  Bottom Layer w0.381: U2.10 72.74,34.93 v1(73.76,33.91) ; U3.10 72.74,26.07 v1(73.76,25.06)
VPP: length 29.3
  Top Layer w0.508: U4.40 62.55,42.28 75.6,55.33 U6.16

## Copper pours and planes (outline as drawn; the poured copper is in the pictures)
GND on Top Layer: 0,72.69 100,72.69 100,0 0,0
GND on Bottom Layer: 0,72.69 100,72.69 100,0 0,0

Small or netless copper shapes (teardrops, artwork), in the pictures only: 111 on Top Layer, 32 on Bottom Layer

## Text on the board
Bottom Silkscreen Layer: TXS0108EPWR
Top Silkscreen Layer: 65 | 66 | 67 | 68 | 69 | 70 | 71 | 72 | 73 | 74 | 75 | 76 | 77 | 78 | 79 | 80 | V1.2 | VPP(HV) | DOUT1/DIN4(B) | DOUT2/DIN3(B) | DOUT3/DIN2(B) | DOUT4/DIN1(B) | ~POL | GND | DIR | VDD(+5V) | ~BL | CLK | ~LE | DIN4/DOUT1(A) | DIN3/DOUT2(A) | DIN2/DOUT3(A) | DIN1/DOUT4(A) | 64 | 63 | 62 | 61 | 60 | 59 | 58 | 57 | 56 | 55 | 54 | 53 | 52 | 51 | 50 | 49 | 48 | 47 | 46 | 45 | 44 | 43 | 42 | 41 | 1 | 2 | 3 | 4 | 5 | 6 | 7 | 8 | 9 | 10 | 11 | 12 | 13 | 14 | 15 | 16 | 17 | 18 | 19 | 20 | 21 | 22 | 23 | 24 | HVOUT40/25 | HVOUT39/26 | HVOUT38/27 | HVOUT37/28 | HVOUT36/29 | HVOUT35/30 | HVOUT34/31 | HVOUT33/32 | HVOUT32/33 | HVOUT31/34 | HVOUT30/35 | HVOUT29/36 | HVOUT28/37 | HVOUT27/38 | HVOUT26/39 | HVOUT25/40 | 40 | 39 | 38 | 37 | 36 | 35 | 34 | 33 | 32 | 31 | 30 | 29 | 28 | 27 | 26 | 25 | HVOUT41/24 | HVOUT42/23 | HVOUT43/22 | HVOUT44/21 | HVOUT45/20 | HVOUT46/19 | HVOUT47/18 | HVOUT48/17 | HVOUT49/16 | HVOUT50/15 | HVOUT51/14 | HVOUT52/13 | HVOUT53/12 | HVOUT54/11 | HVOUT55/10 | HVOUT56/9 | HVOUT57/8 | HVOUT58/7 | HVOUT59/6 | HVOUT60/5 | HVOUT61/4 | HVOUT62/3 | HVOUT63/2 | HVOUT64/1 | HVOUT23/42 | HVOUT22/43 | HVOUT21/44 | HVOUT20/45 | HVOUT19/46 | HVOUT18/47 | HVOUT17/48 | HVOUT16/49 | HVOUT15/50 | HVOUT14/51 | HVOUT13/52 | HVOUT12/53 | HVOUT11/54 | HVOUT10/55 | HVOUT9/56 | HVOUT8/57 | HVOUT7/58 | HVOUT6/59 | HVOUT5/60 | HVOUT4/61 | HVOUT3/62 | HVOUT2/63 | HVOUT1/64 | OE(+3V3) | HVOUT24/41 | +3V3 | HV55708 | 高压:1~24,40~80 | 高压逻辑:41~80 | +3V3逻辑:25~31,33,35~39 | 低压:25~33,35~39 | 请务必保证HV55708PG芯片接地可靠!!! | OE:双向电平转换器输出使能 | 高压危险 | HV55708转接板
